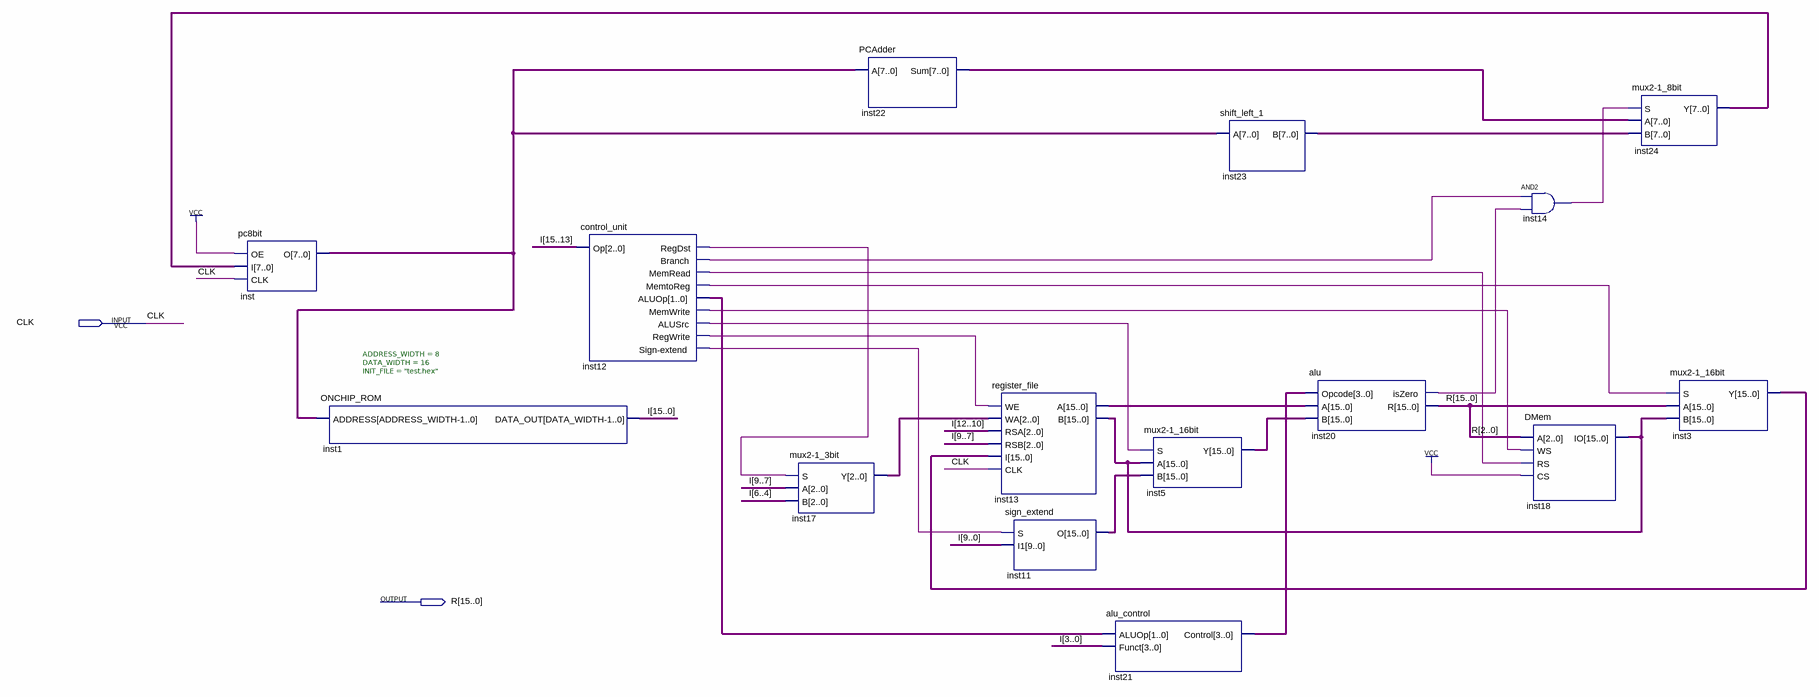
[diagram p0: schematic sheet]
// Quartus schematic datapath.bdf as structural Verilog: 15 symbols, 2 pins
module datapath (
  input  CLK,
  output [15:0] R
);

  wire inst12_alusrc, inst12_branch, inst12_memread, inst12_memtoreg, inst12_memwrite, inst12_regdst,
       inst12_regwrite, inst12_sign_extend, inst14_out, inst20_iszero;
  wire [1:0] inst12_aluop;
  wire [2:0] inst17_y;
  wire [3:0] inst21_control;
  wire [7:0] inst22_sum, inst23_b, inst24_y, inst_o;
  wire [15:0] I, inst3_y, inst5_y, inst11_o, inst13_a, inst13_b;

  pc8bit inst (.OE(1'b1), .I(inst24_y), .CLK(CLK), .O(inst_o));
  ONCHIP_ROM #(.ADDRESS_WIDTH(8), .DATA_WIDTH(16), .INIT_FILE("test.hex")) inst1 (.ADDRESS(inst_o), .DATA_OUT(I));
  control_unit inst12 (
    .Op(I[15:13]), .RegDst(inst12_regdst), .Branch(inst12_branch), .MemRead(inst12_memread),
    .MemtoReg(inst12_memtoreg), .ALUOp(inst12_aluop), .MemWrite(inst12_memwrite), .ALUSrc(inst12_alusrc),
    .RegWrite(inst12_regwrite), .\Sign-extend (inst12_sign_extend));
  \mux2-1_3bit  inst17 (.S(inst12_regdst), .A(I[9:7]), .B(I[6:4]), .Y(inst17_y));
  PCAdder inst22 (.A(inst_o), .Sum(inst22_sum));
  register_file inst13 (
    .WE(inst12_regwrite), .WA(inst17_y), .RSA(I[12:10]), .RSB(I[9:7]), .I(inst3_y), .CLK(CLK), .A(inst13_a),
    .B(inst13_b));
  sign_extend inst11 (.S(inst12_sign_extend), .I1(I[9:0]), .O(inst11_o));
  alu_control inst21 (.ALUOp(inst12_aluop), .Funct(I[3:0]), .Control(inst21_control));
  \mux2-1_16bit  inst5 (.S(inst12_alusrc), .A(inst13_b), .B(inst11_o), .Y(inst5_y));
  shift_left_1 inst23 (.A(inst_o), .B(inst23_b));
  alu inst20 (.Opcode(inst21_control), .A(inst13_a), .B(inst5_y), .isZero(inst20_iszero), .R(R));
  and inst14 (inst14_out, inst12_branch, inst20_iszero);
  DMem inst18 (.A(R[2:0]), .WS(inst12_memwrite), .RS(inst12_memread), .CS(1'b1), .IO(inst13_b));
  \mux2-1_8bit  inst24 (.S(inst14_out), .A(inst22_sum), .B(inst23_b), .Y(inst24_y));
  \mux2-1_16bit  inst3 (.S(inst12_memtoreg), .A(R), .B(inst13_b), .Y(inst3_y));
endmodule
